# EasyEDA schematic SCH_GPS.json

## Sheets
1 PI + Power: TITLE: Sheet_1; REV: 1.0; Date: 2023-09-24; Sheet: 1/1; Drawn By: krauseolly; Company: Your Company
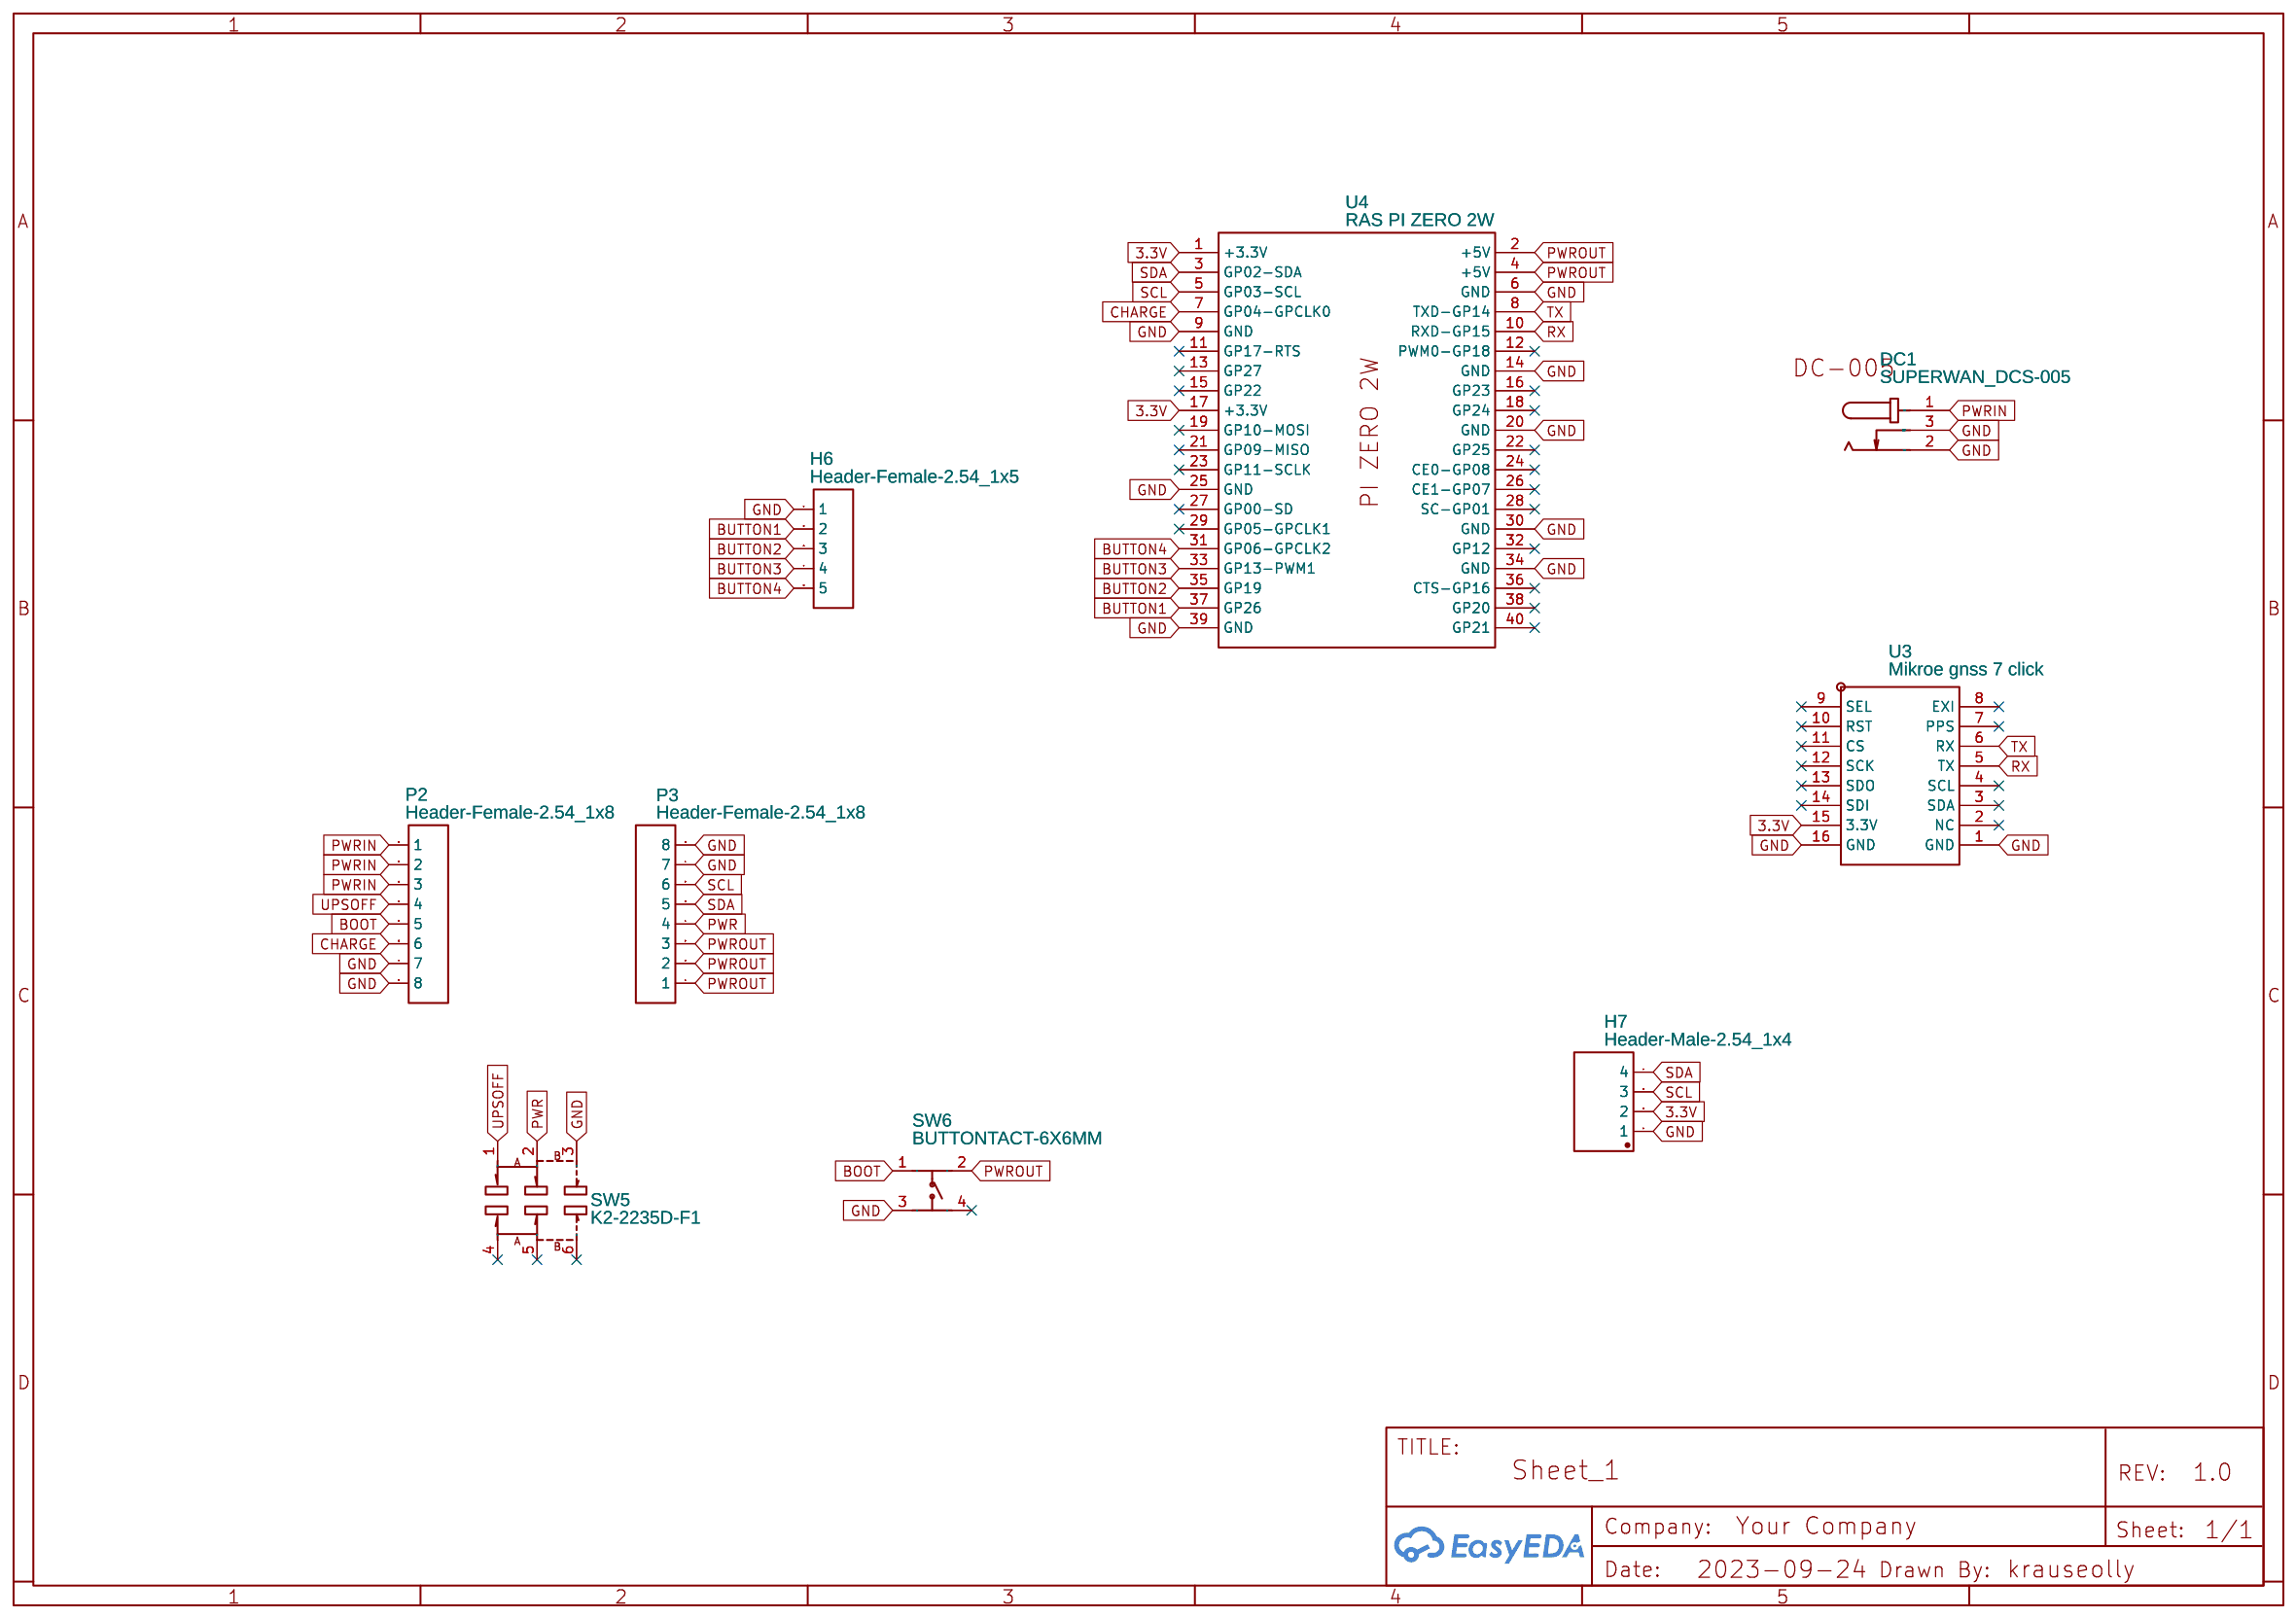
[diagram p0: PI + Power]
2 Screen + Buttons: Date: 2024-02-19
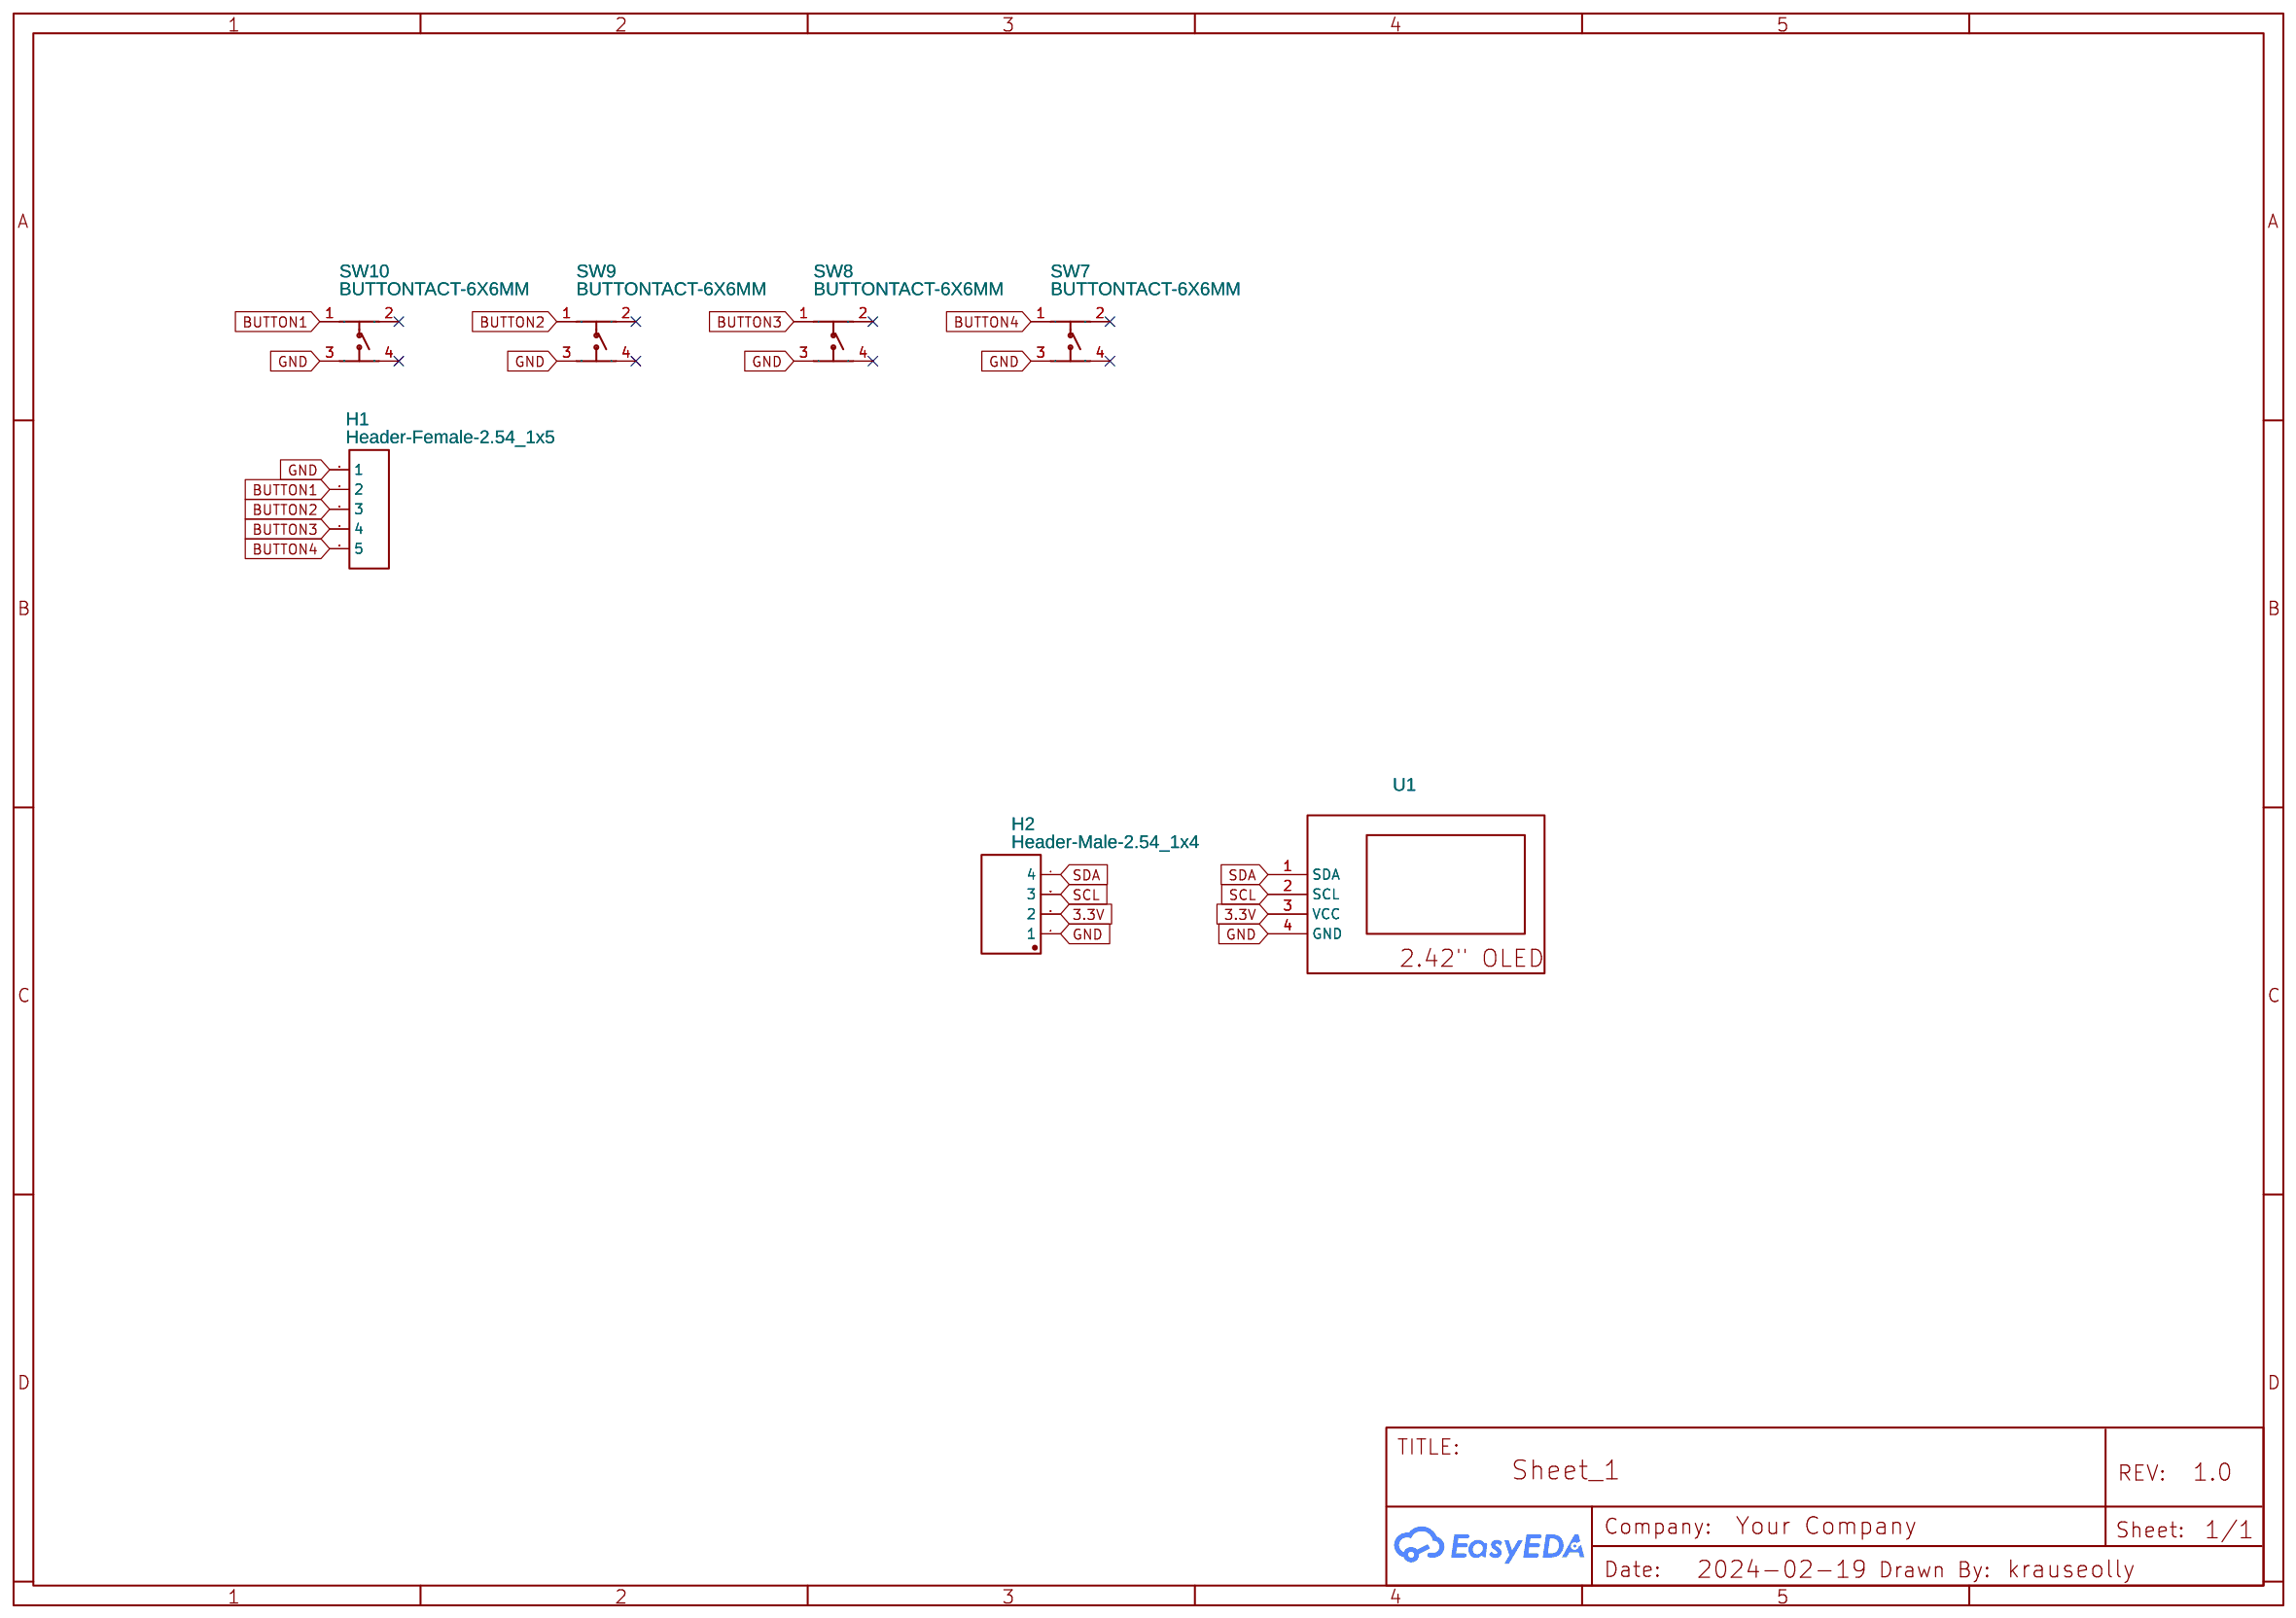
[diagram p1: Screen + Buttons]

## Parts
sheet PI + Power
DC1  SUPERWAN_DCS-005  [SUPERWAN_DCS-005]
H6  Header-Female-2.54_1x5  [HDR-TH_5P-P2.54-V-F]
H7  Header-Male-2.54_1x4  [HDR-TH_4P-P2.54-V-M]
P2  Header-Female-2.54_1x8  [HDR-TH_8P-P2.54-V-F-1]
P3  Header-Female-2.54_1x8  [HDR-TH_8P-P2.54-V-F-1]
SW5  K2-2235D-F1  [SW-TH_K2-2235D-F1]
SW6  BUTTONTACT-6X6MM  [SW-SMD_4P-L6.0-W6.0-P4.50-LS9.2]
U3  Mikroe gnss 7 click  [MIKROE GNSS RTK CLICK]
U4  RAS PI ZERO 2W  [RASP ZERO 2W FIX-2]
sheet Screen + Buttons
H1  Header-Female-2.54_1x5  [HDR-TH_5P-P2.54-V-F]
H2  Header-Male-2.54_1x4  [HDR-TH_4P-P2.54-V-M]
SW7  BUTTONTACT-6X6MM  [SW-SMD_4P-L6.0-W6.0-P4.50-LS9.2]
SW8  BUTTONTACT-6X6MM  [SW-SMD_4P-L6.0-W6.0-P4.50-LS9.2]
SW9  BUTTONTACT-6X6MM  [SW-SMD_4P-L6.0-W6.0-P4.50-LS9.2]
SW10  BUTTONTACT-6X6MM  [SW-SMD_4P-L6.0-W6.0-P4.50-LS9.2]
U1  NO  [2.42_OLED_I2C_ZOS]

## Library data of the parts
DC1 = SUPERWAN_DCS-005: Manufacturer: Tongxuan Store; Manufacturer Part: DCS-005; Supplier Part: ALIEXPRESS; Supplier: ALIEXPRESS; link: https://www.aliexpress.com/store/4822036?spm=a2g0o.detail.100005.1.181633adFUzBMc; Contributor: rewitgo
H1 H6 = Header-Female-2.54_1x5: Supplier: LCSC; Manufacturer: BOOMELE(博穆精密); Manufacturer Part: 2.54-1*5P母; Supplier Part: C50950; JLCPCB Part Class: Extended Part
H2 H7 = Header-Male-2.54_1x4: Contributor: LCSC; Supplier: LCSC; Manufacturer: Ckmtw(灿科盟); Manufacturer Part: B-2100S04P-A110; Supplier Part: C124378; JLCPCB Part Class: Extended Part
P2 P3 = Header-Female-2.54_1x8: Supplier: LCSC; Manufacturer: BOOMELE(博穆精密); Manufacturer Part: 2.54-1*8P母环保; Supplier Part: C27438; JLCPCB Part Class: Extended Part
SW5 = K2-2235D-F1: Contributor: LCSC; Supplier: LCSC; Supplier Part: C108742; Manufacturer: 韩国韩荣; Manufacturer Part: K3-2235D-K1; JLCPCB Part Class: Extended Part
SW6-SW10 = BUTTONTACT-6X6MM: Contributor: LCSC; Supplier: LCSC; Supplier Part: C9900004221; Manufacturer Part: Buttontact-6x6mm; JLCPCB Part Class: Extended Part; link: https://lcsc.com/eda_search?q=C9900004221&%26type=1&ref=editor
U3 = Mikroe gnss 7 click: Manufacturer: MIKROE; Manufacturer Part: GNSS 7 CLICK; Supplier Part: GNSS 7 CLICK; Supplier: Mouser; Contributor: fabio.amore; Package Display: No
U4 = RAS PI ZERO 2W: Manufacturer: RASPBERRY PI; Manufacturer Part: RASPBERRY PI; Supplier: Distrelec; Supplier Part: RASPBRRY PI ZERO WH; link: https://my.cytron.io/p-raspberry-pi-zero-wh-with-header?search=raspberry%20pi%20ZERO&description=1; Contributor: et14moal
U1 = 2.42 OLED (SSD1309, I2C) ZOS: Manufacturer Part: MONOCHROME 2.42" 128X64 OLED SSD1309; link: https://item.taobao.com/item.htm?spm=a1z09.2.0.0.393d2e8dQMigQX&id=595825838972&_u=41ug942ndb7b; Contributor: zossoste

## Nets
3.3V: H2.2 H7.2 U1.3(VCC) U3.15(3.3V) U4.1(+3.3V) U4.17(+3.3V)
GND: DC1.2(SLEEVE (-)) DC1.3(INSERT DETECTION) H1.1 H2.1 H6.1 H7.1 P2.7 P2.8 P3.7 P3.8 SW5.3 SW6.3(C) SW7.3(C) SW8.3(C) SW9.3(C) SW10.3(C) U1.4(GND) U3.1(GND) U3.16(GND) U4.6(GND) U4.9(GND) U4.14(GND) U4.20(GND) U4.25(GND) U4.30(GND) U4.34(GND) U4.39(GND)
BOOT: P2.5 SW6.1(A)
BUTTON1: H1.2 H6.2 SW10.1(A) U4.37(GP26)
BUTTON2: H1.3 H6.3 SW9.1(A) U4.35(GP19)
BUTTON3: H1.4 H6.4 SW8.1(A) U4.33(GP13-PWM1)
BUTTON4: H1.5 H6.5 SW7.1(A) U4.31(GP06-GPCLK2)
CHARGE: P2.6 U4.7(GP04-GPCLK0)
PWR: P3.4 SW5.2
PWRIN: DC1.1(TIP (+)) P2.1 P2.2 P2.3
PWROUT: P3.1 P3.2 P3.3 SW6.2(B) U4.2(+5V) U4.4(+5V)
RX: U3.5(TX) U4.10(RXD-GP15)
SCL: H2.3 H7.3 P3.6 U1.2(SCL) U4.5(GP03-SCL)
SDA: H2.4 H7.4 P3.5 U1.1(SDA) U4.3(GP02-SDA)
TX: U3.6(RX) U4.8(TXD-GP14)
UPSOFF: P2.4 SW5.1

Not connected (* = marked no-connect by the designer): SW5 4* 5* 6*; SW6 4(D)*; SW7 2(B)* 4(D)*; SW8 2(B)* 4(D)*; SW9 2(B)* 4(D)*; SW10 2(B)* 4(D)*; U3 2(NC)* 3(SDA)* 4(SCL)* 7(PPS)* 8(EXI)* 9(SEL)* 10(RST)* 11(CS)* 12(SCK)* 13(SDO)* 14(SDI)*; U4 11(GP17-RTS)* 12(PWM0-GP18)* 13(GP27)* 15(GP22)* 16(GP23)* 18(GP24)* 19(GP10-MOSI)* 21(GP09-MISO)* 22(GP25)* 23(GP11-SCLK)* 24(CE0-GP08)* 26(CE1-GP07)* 27(GP00-SD)* 28(SC-GP01)* 29(GP05-GPCLK1)* 32(GP12)* 36(CTS-GP16)* 38(GP20)* 40(GP21)*
